# Altium schematic sheet RaceDAQ_IN_OUT.SchDoc
size A4; SheetNumber: 2; SheetTotal: 4
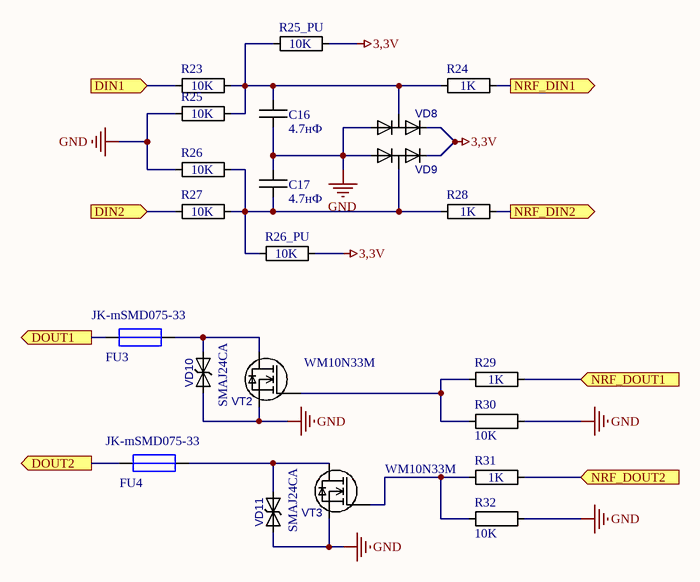
[diagram p0: RaceDAQ_IN_OUT.SchDoc]

## Parts
C16  4.7нФ  [CAPC1608X90L25N]
C17  4.7нФ  [CAPC1608X90L25N]
FU3  JK-mSMD075-33  [FUSE: 1812]
FU4  JK-mSMD075-33  [FUSE: 1812]
R23  10K  [RESC2012X60L35N]
R24  1K  [RESC1608X55L25N]
R25  10K  [RESC2012X60L35N]
R25_PU  10K  [RESC2012X60L35N]
R26  10K  [RESC2012X60L35N]
R26_PU  10K  [RESC2012X60L35N]
R27  10K  [RESC2012X60L35N]
R28  1K  [RESC1608X55L25N]
R29  1K  [RESC1608X55L25N]
R30  10K  [RESC2012X60L35N]
R31  1K  [RESC1608X55L25N]
R32  10K  [RESC2012X60L35N]
VD8  BAT54S  [SOT95P240X110-3L16]  (value not drawn)
VD9  BAT54S  [SOT95P240X110-3L16]  (value not drawn)
VD10  SMAJ24CA  [DIOM5126X229]
VD11  SMAJ24CA  [DIOM5126X229]
VT2  WM10N33M  [SOT95P240X110-3L10]
VT3  WM10N33M  [SOT95P240X110-3L10]

## Ports
DIN1 (in), DIN2 (in), DOUT1 (out), DOUT2 (out), NRF_DIN1 (out), NRF_DIN2 (out), NRF_DOUT1 (in), NRF_DOUT2 (in)

## Nets
3,3V: R25_PU.1 R26_PU.1 VD8.2 VD9.2
GND: C16.1 C17.2 R25.2 R26.1 R30.1 R32.1 VD8.1 VD9.1 VD10.A VD11.A VT2.2 VT3.2
DIN1: R23.1 ; port DIN1
DIN2: R27.1 ; port DIN2
DOUT1: FU3.1 ; port DOUT1
DOUT2: FU4.1 ; port DOUT2
NRF_DIN1: R24.2 ; port NRF_DIN1
NRF_DIN2: R28.2 ; port NRF_DIN2
NRF_DOUT1: R29.2 ; port NRF_DOUT1
NRF_DOUT2: R31.2 ; port NRF_DOUT2
NetC16_2: C16.2 R23.2 R24.1 R25.1 R25_PU.2 VD8.3
NetC17_1: C17.1 R26.2 R26_PU.2 R27.2 R28.1 VD9.3
NetFU3_2: FU3.2 VD10.C VT2.3
NetFU4_2: FU4.2 VD11.C VT3.3
NetR29_1: R29.1 R30.2 VT2.1
NetR31_1: R31.1 R32.2 VT3.1

## Library data of the parts
C16 C17 = C0603: Type: C0603; Value: 4.7нФ
FU3 FU4 = JK-mSMD075-33: Предохраниетель ток срабатывания 1,5А, ток удержания 750мА; Manuf: JINRUI; Current: 1.5A
R23 R25 R25_PU R26 R26_PU R27 R30 R32 = R0805: Type: R0805; Value: 10K
R24 R28 R29 R31 = R0603: Type: R0603; Value: 1K
VD10 VD11 = SMAJ-CA: Type: SMAJ-CA; Value: SMAJ24CA
VT2 VT3 = AO3400: Type: AO3400; Value: WM10N33M
VD8 VD9 = BAT54S: Type: BAT54S; Value: BAT54S